# EAGLE design harp rfid reader v1.0 (EAGLE 9.5.1)

## Sheet 1 of 2
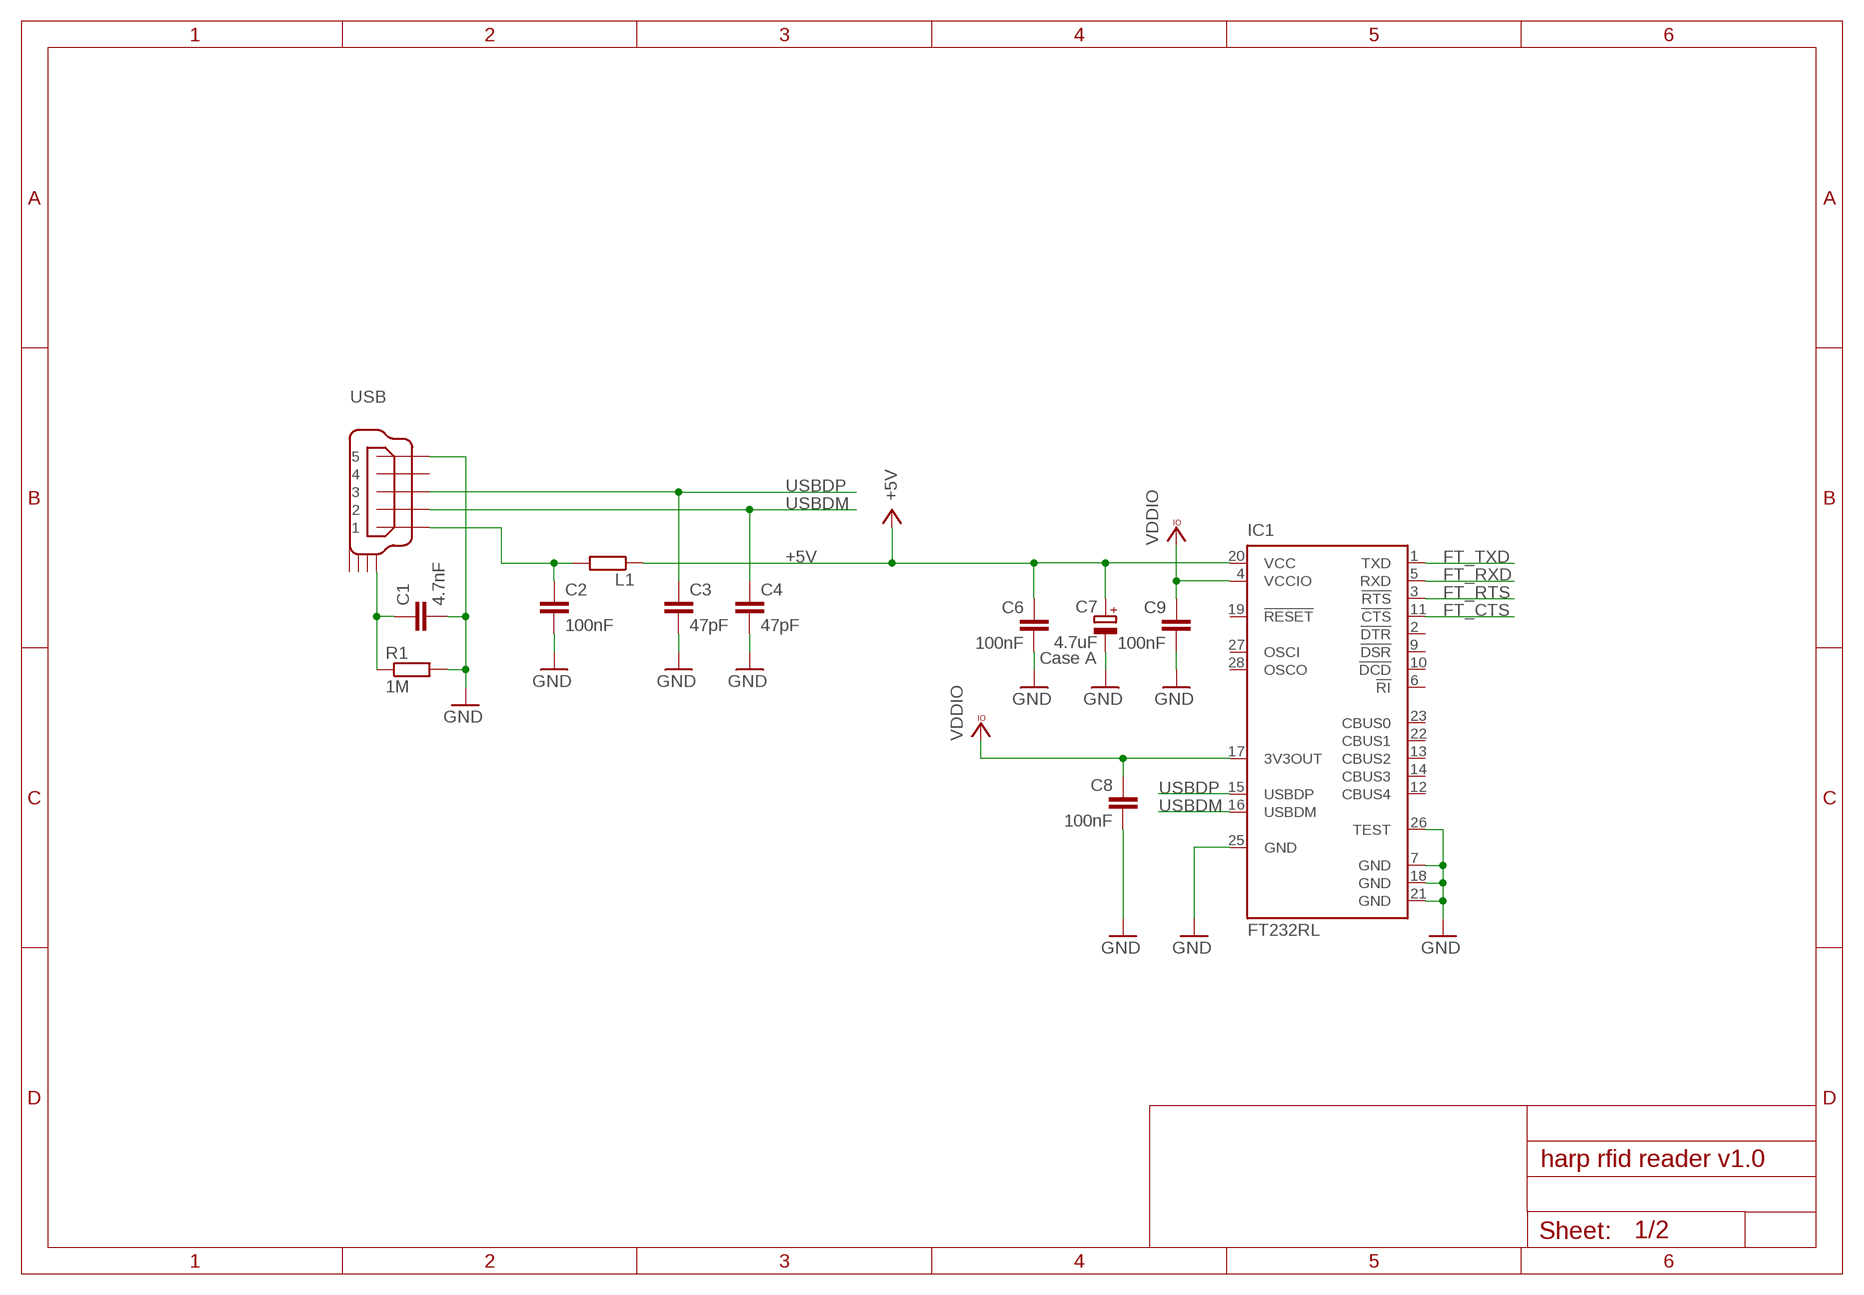
[diagram p0: schematic, sheet 1]

### Parts
C1  4.7nF  C-EUC0402  [C0402]
C2  100nF  C-EUC0402  [C0402]
C3  47pF  C-EUC0402  [C0402]
C4  47pF  C-EUC0402  [C0402]
C6  100nF  C-EUC0402  [C0402]
C7  4.7uF  CPOL-EUA/3216-18W  [A/3216-18W]
C8  100nF  C-EUC0402  [C0402]
C9  100nF  C-EUC0402  [C0402]
IC1  FT232RL  [SSOP28]
L1  ???  R-EU_R0805  [R0805]
R1  1M  R-EU_R0402  [R0402]
USB  USB_MINI_B  [240-0002-1]

### Nets
+5V: C6.1 C7.+ IC1.20(VCC) L1.1 ; also sheet 2
FT_CTS: IC1.11(!CTS) ; also sheet 2
FT_RTS: IC1.3(!RTS) ; also sheet 2
FT_RXD: IC1.5(RXD) ; also sheet 2
FT_TXD: IC1.1(TXD) ; also sheet 2
GND: C1.2 C2.2 C3.2 C4.2 C6.2 C7.- C8.2 C9.2 IC1.7(GND) IC1.18(GND) IC1.21(GND) IC1.25(GND) IC1.26(TEST) R1.2 USB.P$5 ; also sheet 2
N$3: C1.1 R1.1 USB.SHIELD_1
N$39: C2.1 L1.2 USB.P$1
USBDM: C4.1 IC1.16(USBDM) USB.P$2
USBDP: C3.1 IC1.15(USBDP) USB.P$3
VCCIO: C8.1 C9.1 IC1.4(VCCIO) IC1.17(3V3OUT) ; supply symbol labelled VDDIO ; also sheet 2
Unconnected: IC1.2(!DTR) IC1.6(!RI) IC1.9(!DSR) IC1.10(!DCD) IC1.12(CBUS4) IC1.13(CBUS2) IC1.14(CBUS3) IC1.19(!RESET) IC1.22(CBUS1) IC1.23(CBUS0) IC1.27(OSCI) IC1.28(OSCO) USB.P$4 USB.SHIELD_2 USB.SHIELD_3 USB.SHIELD_4

### Notes on the sheet
- Case A

## Sheet 2 of 2
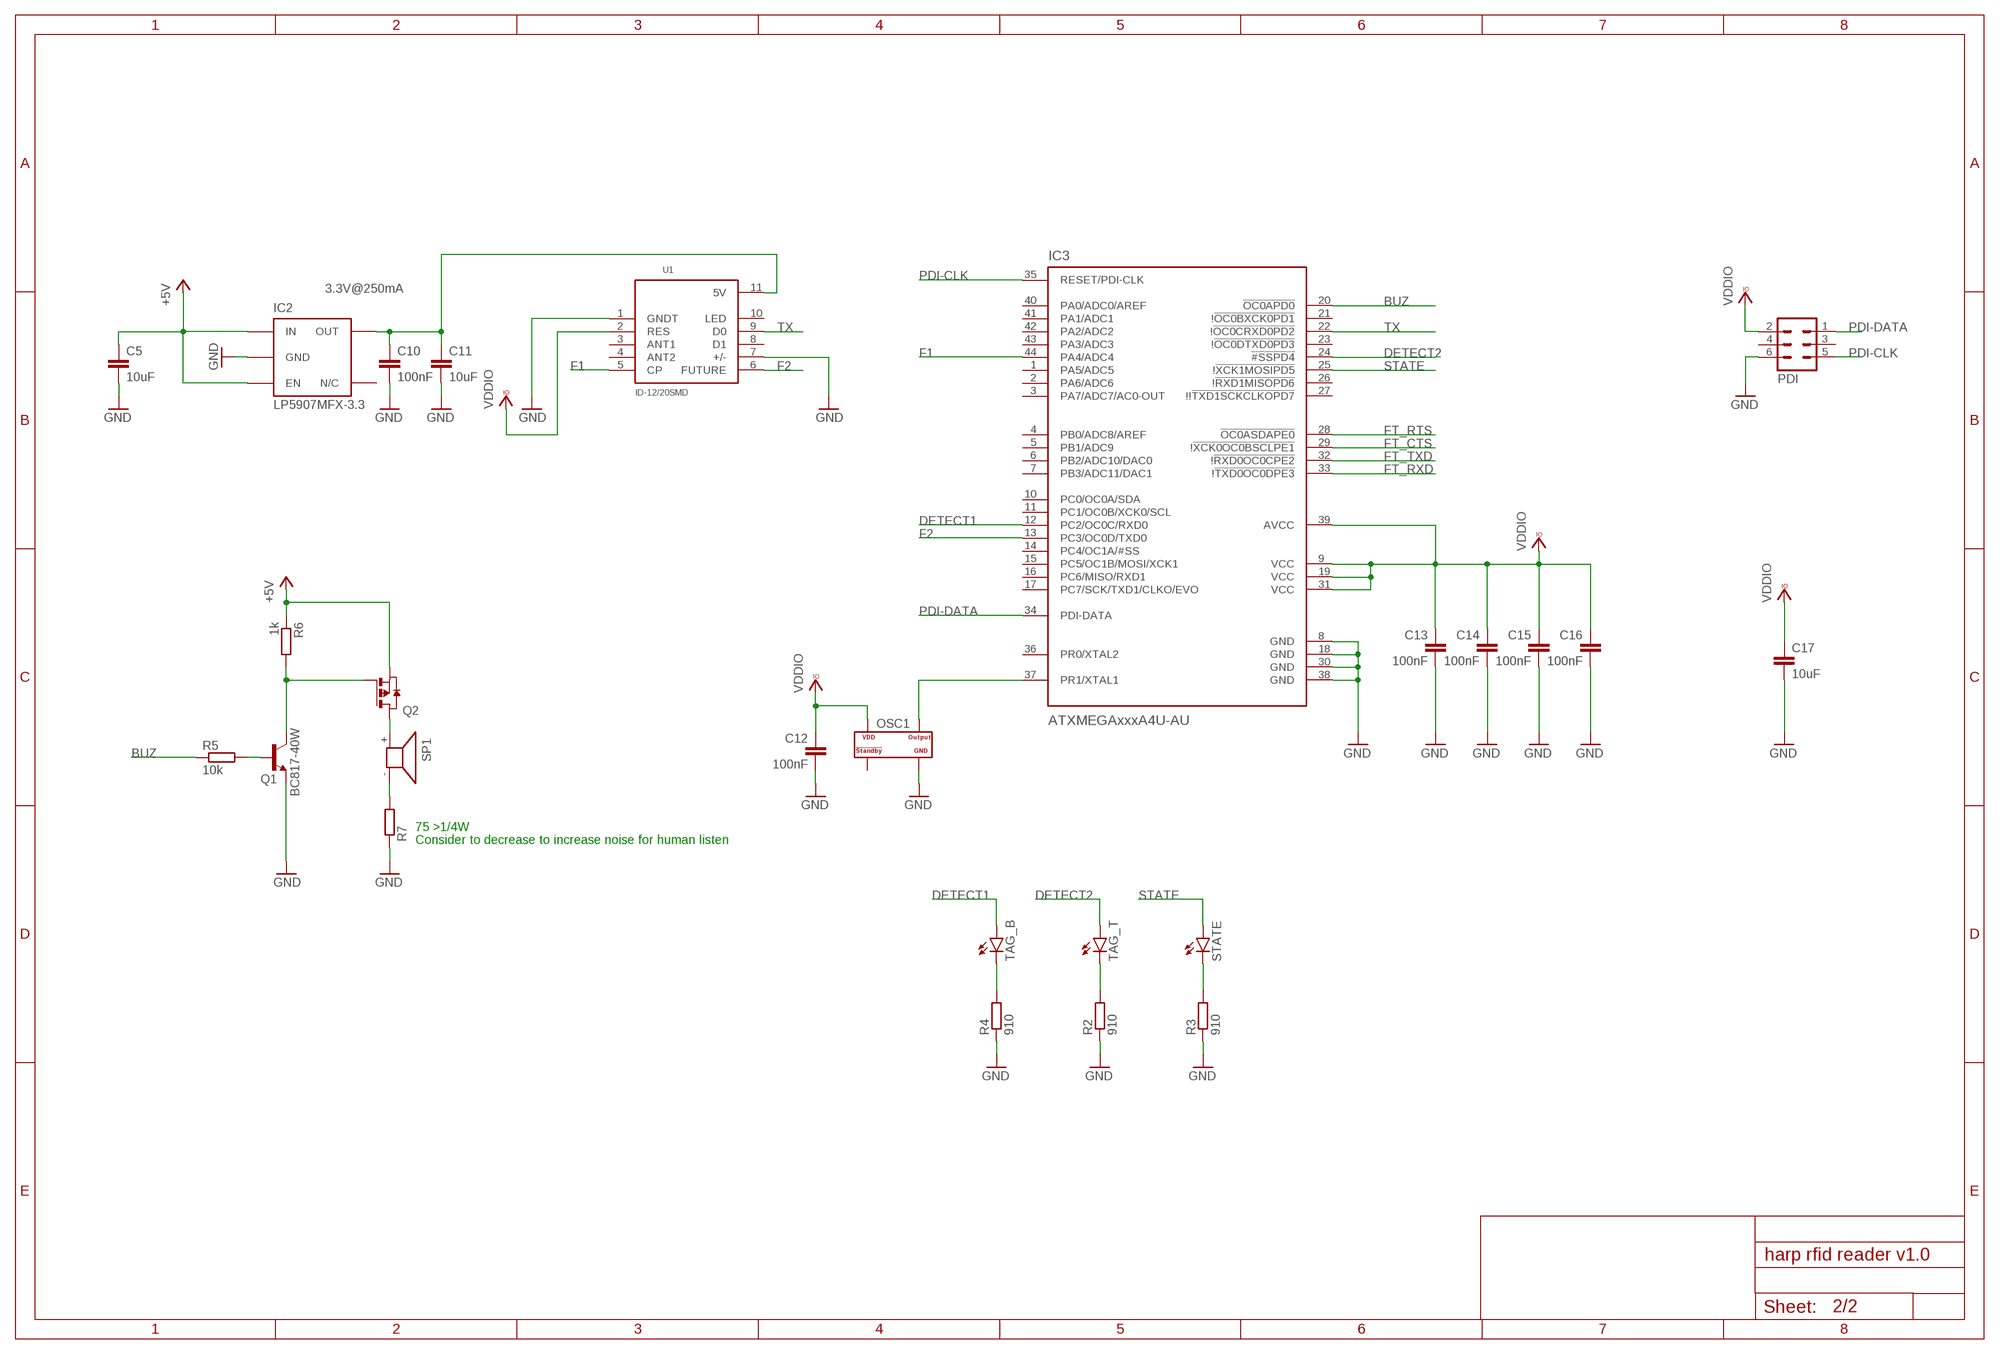
[diagram p1: schematic, sheet 2]

### Parts
C5  10uF  C-EUC0603  [C0603]
C10  100nF  C-EUC0402  [C0402]
C11  10uF  C-EUC0603  [C0603]
C12  100nF  C-EUC0402  [C0402]
C13  100nF  C-EUC0402  [C0402]
C14  100nF  C-EUC0402  [C0402]
C15  100nF  C-EUC0402  [C0402]
C16  100nF  C-EUC0402  [C0402]
C17  10uF  C-EUC0603  [C0603]
IC2  LP5907MFX-3.3  TLV700XX  [TSOT23-5]
IC3  ATXMEGAxxxA4U-AU  AT-XMEGA-XXA4-AU  [QFP80P1200X1200X120-44N]
OSC1  CNP-MISCELLANEOUS_OSCILLATOR  [CNP-MISCELLANEOUS_OSCILLATOR_3.2X2.5]
PDI  MA03-2  [MA03-2]
Q1  BC817-40W  BC817  [SOT323-BEC]
Q2  PMOSSOT223  [SOT223]
R2  910  R-EU_R0402  [R0402]
R3  910  R-EU_R0402  [R0402]
R4  910  R-EU_R0402  [R0402]
R5  10k  R-EU_R0402  [R0402]
R6  1k  R-EU_R0402  [R0402]
R7  75 >1/4W  R-EU_R0402  [R0402]
SP1  BUZZER-COIL_SMT-0540-S-R  [BUZZER-COIL_SMT-0540-S-R]
STATE  LEDCHIP-LED0603  [CHIP-LED0603]
TAG_B  LEDCHIP-LED0603  [CHIP-LED0603]
TAG_T  LEDCHIP-LED0603  [CHIP-LED0603]
U1  ID-12/20SMD  [ID-12_SMD]

### Nets
+5V: C5.1 IC2.1(IN) IC2.3(EN) Q2.3(S) R6.1 ; also sheet 1
BUZ: IC3.20(!OC0APD0) R5.1
BUZ_T: Q2.2(D) Q2.4(D) SP1.+
DETECT1: IC3.12(PC2/OC0C/RXD0) TAG_B.A
DETECT2: IC3.24(!#SSPD4) TAG_T.A
F1: IC3.44(PA4/ADC4) U1.5(CP)
F2: IC3.13(PC3/OC0D/TXD0) U1.6(FUTURE)
FT_CTS: IC3.29(!!XCK0OC0BSCLPE1) ; also sheet 1
FT_RTS: IC3.28(!OC0ASDAPE0) ; also sheet 1
FT_RXD: IC3.33(!!TXD0OC0DPE3) ; also sheet 1
FT_TXD: IC3.32(!!RXD0OC0CPE2) ; also sheet 1
GND: C5.2 C10.2 C11.2 C12.2 C13.2 C14.2 C15.2 C16.2 C17.2 IC2.2(GND) IC3.8(GND) IC3.18(GND) IC3.30(GND) IC3.38(GND) OSC1.P$2(GND) PDI.6 Q1.E R2.1 R3.1 R4.1 R7.1 U1.1(GNDT) U1.7(+/-) ; also sheet 1
N$1: C10.1 C11.1 IC2.5(OUT) U1.11(5V)
N$2: R3.2 STATE.C
N$4: R4.2 TAG_B.C
N$5: R2.2 TAG_T.C
N$20: R7.2 SP1.-
N$25: Q1.C Q2.1(G) R6.2
N$27: Q1.B R5.2
OSC1: IC3.37(PR1/XTAL1) OSC1.P$3(OUTPUT)
PDI-CLK: IC3.35(RESET/PDI-CLK) PDI.5
PDI-DATA: IC3.34(PDI-DATA) PDI.1
STATE: IC3.25(!!XCK1MOSIPD5) STATE.A
TX: IC3.22(!!OC0CRXD0PD2) U1.9(D0)
VCCIO: C12.1 C13.1 C14.1 C15.1 C16.1 C17.1 IC3.9(VCC) IC3.19(VCC) IC3.31(VCC) IC3.39(AVCC) OSC1.P$4(VDD) PDI.2 U1.2(RES) ; supply symbol labelled VDDIO ; also sheet 1
Unconnected: IC2.4(N/C) IC3.1(PA5/ADC5) IC3.2(PA6/ADC6) IC3.3(PA7/ADC7/AC0-OUT) IC3.4(PB0/ADC8/AREF) IC3.5(PB1/ADC9) IC3.6(PB2/ADC10/DAC0) IC3.7(PB3/ADC11/DAC1) IC3.10(PC0/OC0A/SDA) IC3.11(PC1/OC0B/XCK0/SCL) IC3.14(PC4/OC1A/#SS) IC3.15(PC5/OC1B/MOSI/XCK1) IC3.16(PC6/MISO/RXD1) IC3.17(PC7/SCK/TXD1/CLKO/EVO) IC3.21(!!OC0BXCK0PD1) IC3.23(!!OC0DTXD0PD3) IC3.26(!!RXD1MISOPD6) IC3.27(!!!TXD1SCKCLKOPD7) IC3.36(PR0/XTAL2) IC3.40(PA0/ADC0/AREF) IC3.41(PA1/ADC1) IC3.42(PA2/ADC2) IC3.43(PA3/ADC3) OSC1.P$1(STANDBY#) PDI.3 PDI.4 U1.3(ANT1) U1.4(ANT2) U1.8(D1) U1.10(LED)

### Notes on the sheet
- 3.3V@250mA
- 75 >1/4W
- Consider to decrease to increase noise for human listen

## Library data of the parts
C1-C6 C8-C17 = rcl:C-EU: CAPACITOR, European symbol
C7 = rcl:CPOL-EU: POLARIZED CAPACITOR, European symbol
IC1 = ftdichip:FT232R: Source: http://www.ftdichip.com/Documents/DataSheets/DS_FT232R_v104.pdf; MPN: FT232RL; OC_FARNELL: 1146032; OC_NEWARK: 91K9918
IC2 = CNP:TLV700XX
IC3 = xmega-a4:AT-XMEGA-XXA4-AU: ATxMega a4 Serie
L1 R1 R5-R7 = rcl:R-EU_: RESISTOR, European symbol
OSC1 = harp rfid reader v1.0:CNP-MISCELLANEOUS_OSCILLATOR
PDI = con-lstb:MA03-2: PIN HEADER; OC_FARNELL: unknown; OC_NEWARK: unknown
Q1 = transistor-npn:BC817*: NPN Transistor
Q2 = zetex:PMOSSOT223: MOS FET; OC_FARNELL: unknown; OC_NEWARK: unknown
R2-R4 = rcl:R-EU_: RESISTOR, European symbol; SPICEPREFIX: R
SP1 = harp rfid reader v1.0:BUZZER-COIL_SMT-0540-S-R: Buzzers Magnetic Transducer Source: PUI Audio
STATE TAG_B TAG_T = led:LED: LED OSRAM: - CHIPLED LG R971, LG N971, LY N971, LG Q971, LY Q971, LO R971, LY R971 LH N974, LH R974 LS Q976, LO Q976, LY Q976 LO Q996 - Hyper CHIPLED LW Q18S LB Q993, LB Q99A, LB R99A - SideLED LS A670, LO A670, LY A670, LG A670, LP A670 LB A673, LV A673, LT A673, LW A673 LH A674 LY A675 LS A676, LA A676, LO A676, LY A676, LW A676 LS A679, LY A679, LG A679 - Hyper Micro SIDELED® LS Y876, LA Y876, LO Y876, LY Y876 LT Y87S - SmartLED LW L88C, LW L88S LB L89C, LB L89S, LG L890 LS L89K, LO L89K, LY L89K LS L896, LA L896, LO L896, LY L896 - TOPLED LS T670, LO T670, LY T670, LG T670, LP T670 LSG T670, LSP T670, LSY T670, LOP T670, LYG T670 LG T671, LOG T671, LSG T671 LB T673, LV T673, LT T673, LW T673 LH T674 LS T676, LA T676, LO T676, LY T676, LB T676, LH T676, LSB T676, LW T676 LB T67C, LV T67C, LT T67C, LS T67K, LO T67K, LY T67K, LW E67C LS E67B, LA E67B, LO E67B, LY E67B, LB E67C, LV E67C, LT E67C LW T67C LS T679, LY T679, LG T679 LS T770, LO T770, LY T770, LG T770, LP T770 LB T773, LV T773, LT T773, LW T773 LH T774 LS E675, LA E675, LY E675, LS T675 LS T776, LA T776, LO T776, LY T776, LB T776 LHGB T686 LT T68C, LB T68C - Hyper Mini TOPLED® LB M676 - Mini TOPLED Santana® LG M470 LS M47K, LO M47K, LY M47K Source: http://www.osram.convergy.de LUXEON: - LUMILED® LXK2-PW12-R00, LXK2-PW12-S00, LXK2-PW14-U00, LXK2-PW14-V00 LXK2-PM12-R00, LXK2-PM12-S00, LXK2-PM14-U00 LXK2-PE12-Q00, LXK2-PE12-R00, LXK2-PE12-S00, LXK2-PE14-T00, LXK2-PE14-U00 LXK2-PB12-K00, LXK2-PB12-L00, LXK2-PB12-M00, LXK2-PB14-N00, LXK2-PB14-P00, LXK2-PB14-Q00 LXK2-PR12-L00, LXK2-PR12-M00, LXK2-PR14-Q00, LXK2-PR14-R00 LXK2-PD12-Q00, LXK2-PD12-R00, LXK2-PD12-S00 LXK2-PH12-R00, LXK2-PH12-S00 LXK2-PL12-P00, LXK2-PL12-Q00, LXK2-PL12-R00 Source: www.luxeon.com KINGBRIGHT: KA-3528ASYC Source: www.kingbright.com
U1 = SparkFun:ID-12/20: ID2, ID12, and ID20 Package
USB = CNP-connectors:USB_MINI_B

## Board
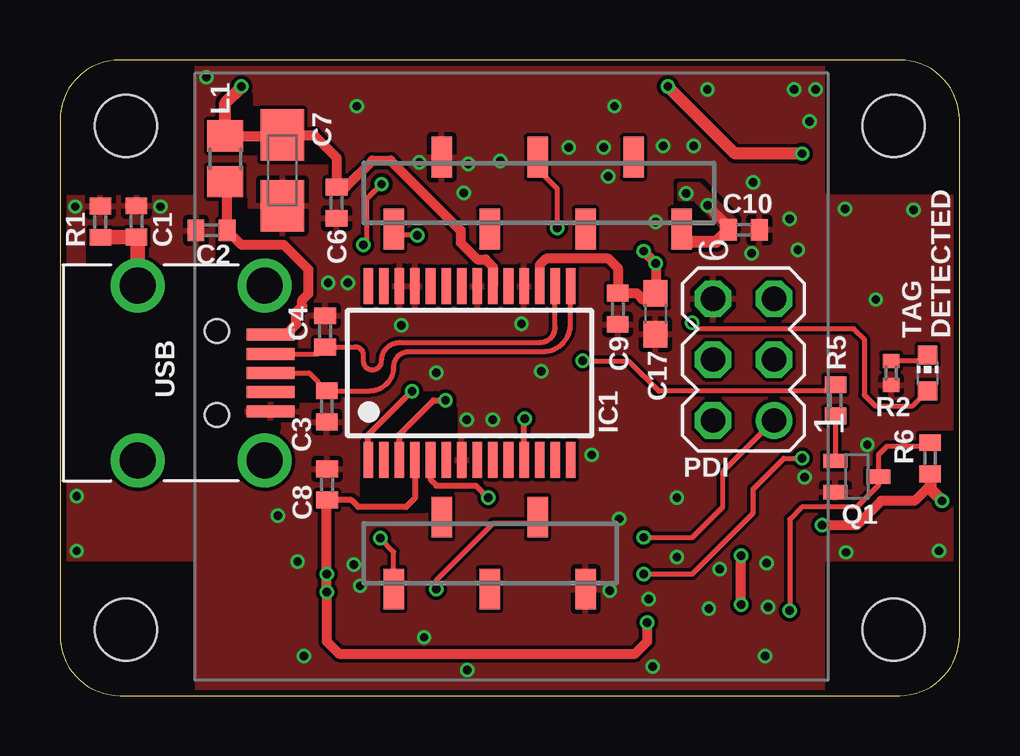
[diagram p2: board, top side]
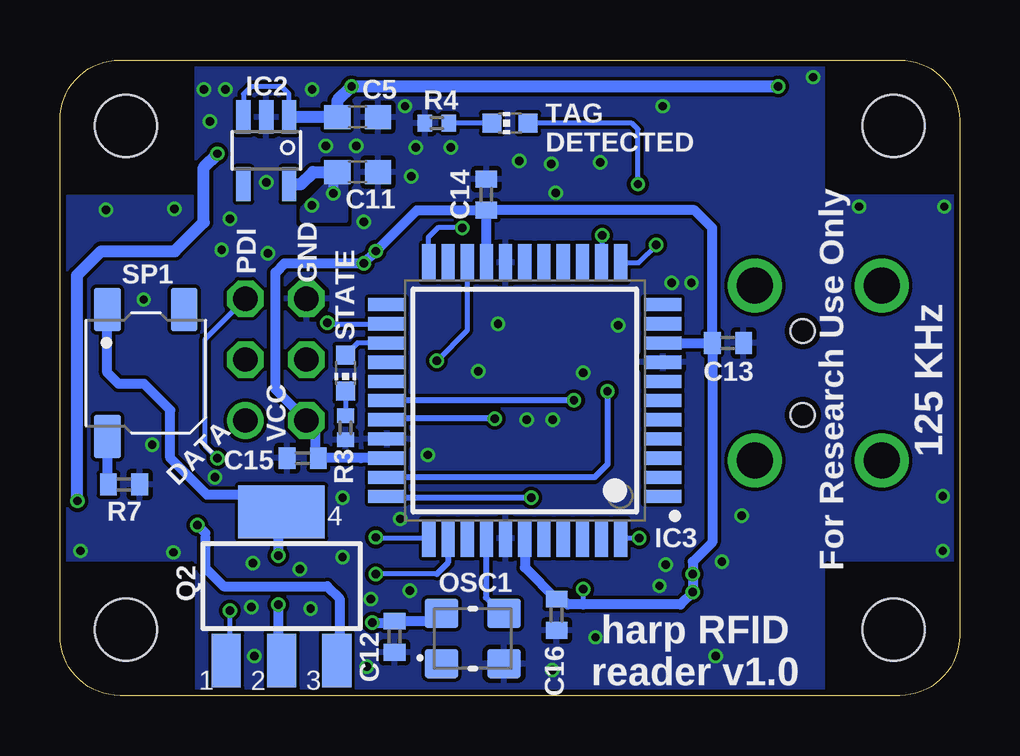
[diagram p3: board, bottom side, seen from below]

Size 37.5 x 26.5 mm. Coordinates in mm from the lower left corner, seen from the top.
Outline: 35,0 arc90 37.5,2.5 37.5,24 arc90 35,26.5 2.5,26.5 arc90 0,24 0,2.5 arc90 2.5,0 35,0
Copper layers (1*16): Top 0.018mm / dielectric 1.55mm / Bottom 0.018mm
Design rules "eC_2Layer_PClass6_BaseCopperO18_eCDefault *": minimum track width 0.15mm, minimum drill 0.35mm, track to track 0.15mm, track to pad 0.15mm, pad to pad 0.15mm, via to via 0.15mm, smd to smd 0mil, copper to edge 0.25mm, drill to drill 0.35mm, minimum pad ring 0.175mm, minimum via ring 0.125mm, stop-mask expansion 0mil, vias tented up to drill 0.45mm, thermal gap 0.2mm
Holes 2.6 mm at 2.75,23.75 34.75,23.75 2.75,2.75 34.75,2.75
tRestrict: 25 lines
bRestrict: 9 lines

### Footprints (pad centres in the part's own frame; a part is rotated, then mirrored left to right if it is on the bottom)
C0402 = smd 0.7 x 0.9: 1 -0.65,0; 2 0.65,0
C0603 = smd 1.1 x 1: 1 -0.85,0; 2 0.85,0
A/3216-18W = smd 2.15 x 1.8: + 1.475,0; - -1.475,0
SSOP28 = smd 0.4 x 1.5: 1 -4.225,-3.625; 2 -3.575,-3.625; 3 -2.925,-3.625; 4 -2.275,-3.625; 5 -1.625,-3.625; 6 -0.975,-3.625; 7 -0.325,-3.625; 8 0.325,-3.625; 9 0.975,-3.625; 10 1.625,-3.625; 11 2.275,-3.625; 12 2.925,-3.625; 13 3.575,-3.625; 14 4.225,-3.625; 15 4.225,3.625; 16 3.575,3.625; 17 2.925,3.625; 18 2.275,3.625; 19 1.625,3.625; 20 0.975,3.625; 21 0.325,3.625; 22 -0.325,3.625; 23 -0.975,3.625; 24 -1.625,3.625; 25 -2.275,3.625; 26 -2.925,3.625; 27 -3.575,3.625; 28 -4.225,3.625
TSOT23-5 = smd 0.6 x 1.408: 1 -0.95,-1.404; 2 0,-1.404; 3 0.95,-1.404; 4 0.95,1.404; 5 -0.95,1.404
QFP80P1200X1200X120-44N = smd 1.55 x 0.55: 1 -5.75,4; 2 -5.75,3.2; 3 -5.75,2.4; 4 -5.75,1.6; 5 -5.75,0.8; 6 -5.75,0; 7 -5.75,-0.8; 8 -5.75,-1.6; 9 -5.75,-2.4; 10 -5.75,-3.2; 11 -5.75,-4; 23 5.75,-4; 24 5.75,-3.2; 25 5.75,-2.4; 26 5.75,-1.6; 27 5.75,-0.8; 28 5.75,0; 29 5.75,0.8; 30 5.75,1.6; 31 5.75,2.4; 32 5.75,3.2; 33 5.75,4 | smd 0.55 x 1.55: 12 -4,-5.75; 13 -3.2,-5.75; 14 -2.4,-5.75; 15 -1.6,-5.75; 16 -0.8,-5.75; 17 0,-5.75; 18 0.8,-5.75; 19 1.6,-5.75; 20 2.4,-5.75; 21 3.2,-5.75; 22 4,-5.75; 34 4,5.75; 35 3.2,5.75; 36 2.4,5.75; 37 1.6,5.75; 38 0.8,5.75; 39 0,5.75; 40 -0.8,5.75; 41 -1.6,5.75; 42 -2.4,5.75; 43 -3.2,5.75; 44 -4,5.75
R0805 = smd 1.3 x 1.5: 1 -0.95,0; 2 0.95,0
CNP-MISCELLANEOUS_OSCILLATOR_3.2X2.5 = smd 1.4 x 1.2: P$1 -1.3,-1.05; P$2 1.3,-1.05; P$3 1.3,1.05; P$4 -1.3,1.05
MA03-2 = drill 1.016: 1 -2.54,-1.27 | drill 1.016 octagon: 2 -2.54,1.27; 3 0,-1.27; 4 0,1.27; 5 2.54,-1.27; 6 2.54,1.27
SOT323-BEC = smd 0.6 x 1: B -0.65,-0.9; C 0,0.9; E 0.65,-0.9
SOT223 = smd 1.219 x 2.235: 1 -2.311,-3.099; 2 0,-3.099; 3 2.311,-3.099 | smd 3.6 x 2.2: 4 0,3.099
R0402 = smd 0.7 x 0.9: 1 -0.65,0; 2 0.65,0
R0402' = smd 0.6 x 0.7: 1 -0.5,0; 2 0.5,0
BUZZER-COIL_SMT-0540-S-R = smd 1.1 x 1.8: 3 1.6,2.65; + -1.6,2.65; - -1.6,-2.65
CHIP-LED0603 = smd 0.8 x 0.8: A 0,-0.75; C 0,0.75
ID-12_SMD = smd 0.85 x 1.7: 1 16.248,3.81; 2 14.248,6.81; 3 12.248,3.81; 4 10.248,6.81; 5 8.248,3.81; 6 8.248,18.822; 7 10.248,21.822; 8 12.248,18.822; 9 14.248,21.822; 10 16.248,18.822; 11 20.248,18.822; NC 18.248,21.822
240-0002-1 = smd 0.5 x 2: P$1 -1.6,8.65; P$2 -0.8,8.65; P$3 0,8.65; P$4 0.8,8.65; P$5 1.6,8.65 | drill 1.5: SHIELD_1 -3.65,3.1; SHIELD_2 3.65,3.1; SHIELD_3 3.65,8.4; SHIELD_4 -3.65,8.4 | hole 1: -1.75,6.4; 1.75,6.4

### Placement (x,y rotation side)
C1  3.19,19.77 90 top
C2  6.32,19.39 180 top
C3  11.12,12.06 270 top
C4  11.05,15.18 90 top
C5  25.09,24.12 0 bottom
C6  11.53,20.55 270 top
C7  9.27,21.89 90 top
C8  11.13,8.8 90 top
C9  23.26,16.13 270 top
C10  28.51,19.42 0 top
C11  25.09,21.83 0 bottom
C12  23.55,2.46 270 bottom
C13  9.65,14.7 0 bottom
C14  19.72,20.88 90 bottom
C15  27.38,9.9 180 bottom
C16  16.8,3.37 270 bottom
C17  24.83,15.92 270 top
IC1  17.07,13.45 0 top
IC2  28.9,22.72 180 bottom
IC3  18.12,12.3 180 bottom
L1  6.89,22.38 270 top
OSC1  20.29,2.38 0 bottom
PDI  28.49,14.01 90 top
Q1  33.22,9.13 270 top
Q2  28.27,4.56 0 bottom
R1  1.68,19.75 90 top
R2  910  [R0402']  34.65,13.45 90 top
R3  910  [R0402']  25.6,11.16 90 bottom
R4  910  [R0402']  21.79,23.86 0 bottom
R5  32.33,12.31 270 top
R6  36.27,9.89 90 top
R7  34.83,8.8 180 bottom
SP1  33.92,13.45 0 bottom
STATE  25.6,13.45 180 bottom
TAG_B  18.74,23.86 90 bottom
TAG_T  36.16,13.45 0 top
U1  5.67,0.63 0 top
USB  0.13,13.45 270 top

### Tracks (layer width: path | path; a pad name or v marks a point on that pad's centre or on a via)
+5V  (via drill 0.35)
  Top 0.406: L1.1 9.23,23.33 C7.+ 10.6,23.37 11.53,22.44 C6.1 11.91,21.2 13.02,22.31 13.79,22.31 16.71,19.39 16.71,18.88 17.41,18.18 17.75,18.18 18.05,17.88 IC1.20 | R6.1 36.27,8.76 35.63,8.12 34.23,8.12 33.22,7.1 v31.76,7.1
  Top 0.508: L1.1 6.89,24.72 v7.56,25.39 | R6.1 36.27,8.62 v36.77,8.12 | v30.93,22.59 28.14,22.59 v25.34,25.39
  Bottom 0.203: IC2.1 27.95,25.07 28.27,25.39 29.54,25.39 29.85,25.07 IC2.3 | 31.44,6.78 31.44,6.59
  Bottom 0.406: v31.76,7.1 31.44,6.78 | 31.44,6.59 31.44,5.32 30.68,4.56 26.36,4.56 25.85,4.05 25.85,1.56 Q2.3
  Bottom 0.508: IC2.1 C5.1 25.94,24.79 v25.34,25.39 v7.56,25.39 | v36.77,8.12 36.78,8.12 36.78,17.52 35.77,18.53 32.71,18.53 31.5,19.74 31.5,22.02 v30.93,22.59
BUZ  (via drill 0.35)
  Top 0.203: v21.79,13.96 23.7,13.96 24.97,12.69 32.06,12.69 R5.1
  Bottom 0.203: IC3.20 20.52,15.22 v21.79,13.96
BUZ_T  (via drill 0.35)
  Top 0.406: v28.39,3.8 v28.39,5.83
  Bottom 0.406: Q2.2 28.39,1.59 v28.39,3.8 | v28.39,5.83 28.39,7.53 Q2.4 28.27,7.99 28.65,8.37 31.37,8.37 32.9,9.9 32.9,11.9 34,13 35.06,13 35.52,13.46 SP1.+
DETECT1  (via drill 0.35)
  Top 0.203: v12.64,18.78 12.77,18.91 12.77,20.69 v13.41,21.32
  Bottom 0.203: IC3.12 13.38,18.05 v12.64,18.78 | v13.41,21.32 13.41,23.61 13.66,23.86 TAG_B.A
DETECT2  (via drill 0.35)
  Top 0.203: v26.36,15.55 26.61,15.29 33.1,15.29 33.52,14.87 33.52,12.54 33.98,12.08 35.54,12.08 TAG_T.A
  Bottom 0.203: v26.36,15.55 26.31,15.5 IC3.24
F1  (via drill 0.35)
  Top 0.203: U1.5 13.91,6 v13.35,6.57
  Bottom 0.203: v13.35,6.57 13.36,6.55 IC3.44
F2  (via drill 0.35)
  Top 0.203: v14.9,19.19 14.17,19.19 U1.6
  Bottom 0.203: v14.9,19.19 14.9,18.08 IC3.13
FT_CTS  (via drill 0.35)
  Top 0.254: IC1.11 19.35,11.52 v19.38,11.54
  Bottom 0.254: v19.38,11.54 23.83,11.54 IC3.29
FT_RTS  (via drill 0.35)
  Top 0.254: IC1.3 14.15,10.89 15.56,12.31 v16.07,12.31
  Bottom 0.254: v16.07,12.31 v16.08,12.3 IC3.28
FT_RXD  (via drill 0.35)
  Top 0.254: IC1.5 15.45,8.99 15.69,8.75 17.34,8.75 v17.85,8.24
  Bottom 0.254: v17.85,8.24 23.82,8.24 IC3.33
FT_TXD  (via drill 0.35)
  Top 0.254: IC1.1 12.85,10.86 v14.68,12.69
  Bottom 0.254: v14.68,12.69 14.68,9.64 15.22,9.1 IC3.32
GND  (via drill 0.35)
  other vias: 28.89,21.4 30.61,25.27 31.5,25.27 31.24,23.94 35.59,20.26 34.01,16.51 28.83,18.44 30.76,18.58 30.42,19.88 32.73,20.29 24.83,19.75 22.86,21.65 22.67,22.86 25.15,22.92 26.42,22.92 29.4,1.65 24.7,1.21 24.54,4.03 27.05,3.62 29.53,3.68 27.5,5.27 29.46,5.52 25.72,5.78 22.92,4.38 23.3,7.37 25.72,8.26 32.77,5.97 36.64,6.03 33.66,10.46 31.04,9.11 16.98,1.07 15.18,2.43 10.16,1.65 12.51,4.57 12.26,5.46 9.91,5.59 9.08,7.49 0.7,6.03 0.7,8.32 22.16,10.03 18.03,11.49 16.95,11.49 15.68,13.46 20.07,13.53 19.24,15.49 14.22,15.43 11.18,17.21 12,17.21 0.64,20.38 4.19,20.38 17.02,22.16 16.83,20.95 18.35,22.29 14.99,22.23 21.21,22.86 12.38,24.57 23.11,24.57 26.99,25.27 6.1,25.78
  pour Bottom (rank 2): 37.5,-0.5 37.5,27 0,27 0,-0.5
  pour Top (rank 2): 37.5,-0.5 37.5,27 0,27 0,-0.5
N$1  (via drill 0.35)
  Top 0.406: v27,20.43 27.86,19.57 C10.1
  Top 0.508: C10.1 27.35,18.91 25.91,18.91 U1.11
  Bottom 0.406: C11.1 26.11,21.67 v26.11,20.94
  Bottom 0.508: IC2.5 27.47,21.32 26.96,21.83 C11.1
  pour Bottom (no thermals): 25.6,21.32 25.6,19.8 27.38,19.8 27.38,20.31 26.36,21.32
  pour Top (no thermals): 25.85,21.32 26.61,21.32 28.13,19.81 28.13,19.54 27.62,19.54 26.61,20.55 26.61,20.56 26.49,20.69 25.85,20.69
N$2
  Bottom 0.203: STATE.C R3.2
N$3
  Top 0.61: R1.1 1.7,19.12 C1.1 3.23,19.08 USB.SHIELD_1
N$4
  Bottom 0.203: TAG_B.C R4.2
N$5
  Top 0.203: TAG_T.C 35.91,13.95 R2.2
N$20
  Bottom 0.406: R7.2 35.52,8.84 SP1.-
N$25  (via drill 0.35)
  Top 0.203: R6.2 36.13,10.4 34.49,10.4 34.12,10.03 Q1.C 34.12,8.76 33.22,7.86 30.93,7.86 30.42,7.35 v30.42,3.54
  Bottom 0.203: v30.42,3.54 30.42,1.61 Q2.1
N$27
  Top 0.203: R5.2 32.33,9.79 Q1.B
N$39
  Top 0.406: USB.P$1 9.42,15.05 9.85,15.48 9.85,15.99 10.1,16.24 10.1,16.5 10.36,16.75 10.36,17.77 9.34,18.78 7.58,18.78 C2.1 6.97,21.36 L1.2
OSC1
  Bottom 0.254: IC3.37 19.75,6.52 19.75,4.09 19.09,3.43 OSC1.P$3
PDI-CLK  (via drill 0.35)
  Top 0.203: v24.33,5.07 26.36,5.07 28.9,7.61 28.9,8.62 30.17,9.89 v30.93,9.89
  Bottom 0.203: 21.79,5.07 v24.33,5.07 | v30.93,9.89 31.44,10.4 31.44,14.87 PDI.5
  Bottom 0.254: IC3.35 21.32,5.53 21.79,5.07
PDI-DATA  (via drill 0.35)
  Top 0.203: v24.33,6.59 26.36,6.59 27.63,7.86 27.63,9.34 PDI.1
  Bottom 0.203: IC3.34 24.29,6.55 v24.33,6.59
STATE
  Bottom 0.203: IC3.25 25.1,14.7 STATE.A
TX  (via drill 0.35)
  Top 0.203: U1.9 19.91,21.95 20.73,21.13 v20.73,19.51
  Bottom 0.203: v20.73,19.51 21.74,19.51 22.15,19.1 22.15,18.07 IC3.22
USBDM
  Top 0.203: USB.P$2 10.77,14.25 C4.1 12.32,14.53 arc-90 12.64,14.21 12.64,13.96 arc90 13.03,13.58 arc90 13.41,13.96 arc-90 14.17,14.72 20.01,14.72 arc90 20.64,15.36 IC1.16 arc-90 IC1.16
USBDP
  Top 0.203: USB.P$3 10.38,13.45 C3.1 12.92,12.71 arc90 13.91,13.7 arc-90 14.55,14.34 20.14,14.34 arc90 21.28,15.48 21.28,17.06 arc-90 IC1.15
VCCIO  (via drill 0.35)
  Top 0.203: U1.2 19.66,7.18 18.06,7.18 15.69,4.81 v15.69,4.43
  Top 0.254: IC1.4 14.8,8.24 14.42,7.86 12.44,7.86 12.15,8.15 11.37,8.15 C8.1
  Top 0.406: IC1.17 20,17.95 20.26,18.21 22.87,18.21 23.26,17.83 C9.1 24.05,16.78 24.33,16.5 24.56,16.5 C17.1 24.84,16.79 v24.84,18.01 v24.33,18.53 | v24.48,3.04 24.48,2.26 23.97,1.75 11.63,1.75 11.12,2.26 v11.12,4.31 v11.12,5.07 11.12,7.9 11.37,8.15
  Bottom 0.203: v15.69,4.43 15.69,3.8 | 22.09,3.11 21.91,3.11 OSC1.P$4
  Bottom 0.406: C13.1 10.3,19.49 11.05,20.23 C14.1 | C14.1 22.62,20.23 v24.33,18.53 v24.84,18.02 28.14,18.02 28.52,17.64 28.52,12.76 PDI.2 26.87,11.11 26.87,10.29 26.73,10.15 C15.1 24.95,9.9 IC3.31 | C13.1 10.3,6.39 11.12,5.58 v11.12,4.31 11.63,3.8 15.69,3.8 16.33,3.8 16.55,4.02 C16.1 18.12,5.34 IC3.39 | v24.48,3.04 23.62,3.04 C12.1 22.09,3.11 | IC3.19 C14.1 | C14.1 | IC3.9 C13.1 | C13.1

### Text on the board
tPlace: TAG / DETECTED
bPlace: TAG / DETECTED | GND | PDI | 125 KHz | For Research Use Only | DATA | VCC | harp RFID / reader v1.0